# Altium schematic sheet USB.SchDoc
size A3; SheetNumber: 2; SheetTotal: 9
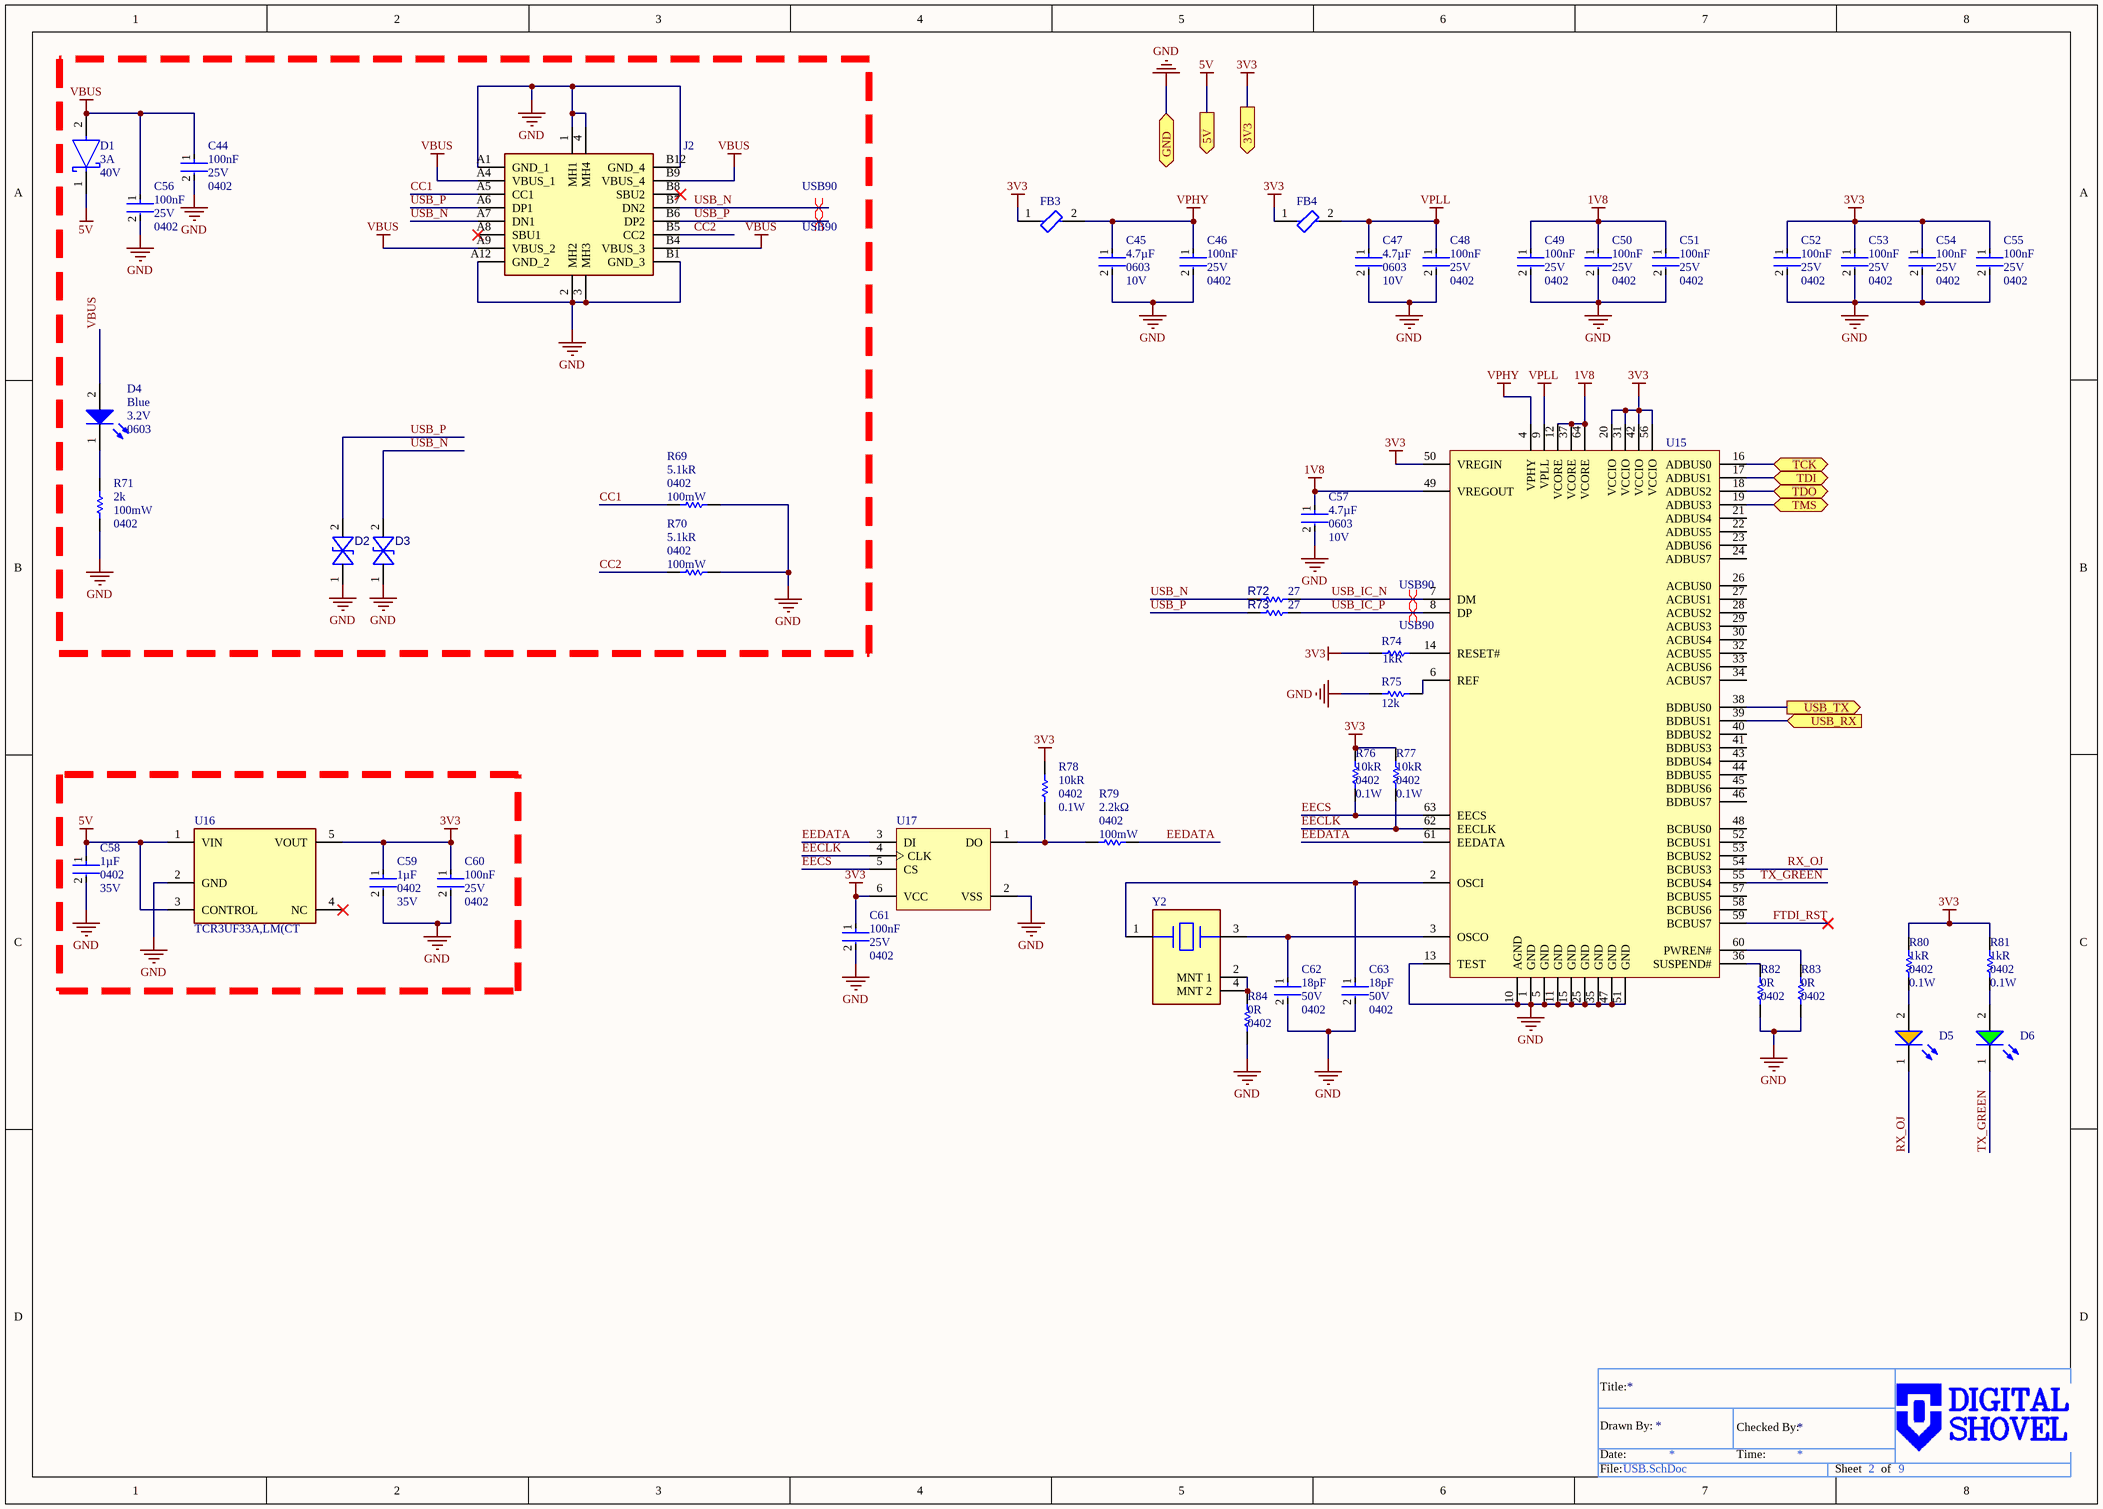
[diagram p0: USB.SchDoc]

## Parts
C44  value 100nF  Voltage Rating: 25V  Case/Package: 0402  [FP-CL830-IPC_A]  (hidden comment: CL05B104KA5NNNC)
C45  value 4.7µF  Case/Package: 0603  Voltage Rating: 10V  [FP-CL10-IPC_A]  (hidden comment: CL10A475KP8NNNC)
C46  value 100nF  Voltage Rating: 25V  Case/Package: 0402  [FP-CL830-IPC_A]  (hidden comment: CL05B104KA5NNNC)
C47  value 4.7µF  Case/Package: 0603  Voltage Rating: 10V  [FP-CL10-IPC_A]  (hidden comment: CL10A475KP8NNNC)
C48  value 100nF  Voltage Rating: 25V  Case/Package: 0402  [FP-CL830-IPC_A]  (hidden comment: CL05B104KA5NNNC)
C49  value 100nF  Voltage Rating: 25V  Case/Package: 0402  [FP-CL830-IPC_A]  (hidden comment: CL05B104KA5NNNC)
C50  value 100nF  Voltage Rating: 25V  Case/Package: 0402  [FP-CL830-IPC_A]  (hidden comment: CL05B104KA5NNNC)
C51  value 100nF  Voltage Rating: 25V  Case/Package: 0402  [FP-CL830-IPC_A]  (hidden comment: CL05B104KA5NNNC)
C52  value 100nF  Voltage Rating: 25V  Case/Package: 0402  [FP-CL830-IPC_A]  (hidden comment: CL05B104KA5NNNC)
C53  value 100nF  Voltage Rating: 25V  Case/Package: 0402  [FP-CL830-IPC_A]  (hidden comment: CL05B104KA5NNNC)
C54  value 100nF  Voltage Rating: 25V  Case/Package: 0402  [FP-CL830-IPC_A]  (hidden comment: CL05B104KA5NNNC)
C55  value 100nF  Voltage Rating: 25V  Case/Package: 0402  [FP-CL830-IPC_A]  (hidden comment: CL05B104KA5NNNC)
C56  value 100nF  Voltage Rating: 25V  Case/Package: 0402  [FP-CL830-IPC_A]  (hidden comment: CL05B104KA5NNNC)
C57  value 4.7µF  Case/Package: 0603  Voltage Rating: 10V  [FP-CL10-IPC_A]  (hidden comment: CL10A475KP8NNNC)
C58  value 1µF  Case/Package: 0402  Voltage Rating: 35V  [FP-C1005-050-0_05-IPC_A]  (hidden comment: C1005JB1V105K050BC)
C59  value 1µF  Case/Package: 0402  Voltage Rating: 35V  [FP-C1005-050-0_05-IPC_A]  (hidden comment: C1005JB1V105K050BC)
C60  value 100nF  Voltage Rating: 25V  Case/Package: 0402  [FP-CL830-IPC_A]  (hidden comment: CL05B104KA5NNNC)
C61  value 100nF  Voltage Rating: 25V  Case/Package: 0402  [FP-CL830-IPC_A]  (hidden comment: CL05B104KA5NNNC)
C62  value 18pF  Case/Package: 0402  Voltage Rating: 50V  [FP-GJM155-0_05-IPC_A]  (hidden comment: GJM1555C1H180GB01D)
C63  value 18pF  Case/Package: 0402  Voltage Rating: 50V  [FP-GJM155-0_05-IPC_A]  (hidden comment: GJM1555C1H180GB01D)
D1  value 3A  Voltage Rating: 40V  [FP-SOD123W-MFG]  (hidden comment: PMEG3020ER,115)
D2  TPD1E01B04DPYR  [TPD1E01B04DPYR-Footprint-1]  (value not drawn)
D3  TPD1E01B04DPYR  [TPD1E01B04DPYR-Footprint-1]  (value not drawn)
D4  Forward Voltage: 3.2V  Case/Package: 0603  Colour: Blue  [WL-SMCW_0603_150060xx75000]  (hidden comment: 150060BS75000)
D5  150060AS75000  [WL-SMCW_0603_150060xx75000]  (value not drawn)
D6  150060VS75000  [WL-SMCW_0603_150060xx75000]  (value not drawn)
FB3  BLM21PG300SN1D  [FP-BLM21-0_2-t0_85-e0_5-d-MFG]  (value not drawn)
FB4  BLM21PG300SN1D  [FP-BLM21-0_2-t0_85-e0_5-d-MFG]  (value not drawn)
J2  USB4145-03-0170-C  [GCT_USB4145-03-0170-C_REVA2]  (value not drawn)
R69  value 5.1kR  Package: 0402  Power: 100mW  [RESC1005X40X25LL10T10]  (hidden comment: RK73H1ETTP5101F)
R70  value 5.1kR  Package: 0402  Power: 100mW  [RESC1005X40X25LL10T10]  (hidden comment: RK73H1ETTP5101F)
R71  value 2k  Case/Package: 0402  Power: 100mW  [RESC1005X40X25LL10T10]  (hidden comment: RK73H1ETTP2001F)
R72  value 27  [RK73H1ETTP27R0F-Footprint-1]  (hidden comment: RK73H1ETTP27R0F)
R73  value 27  [RK73H1ETTP27R0F-Footprint-1]  (hidden comment: RK73H1ETTP27R0F)
R74  value 1kR  [RESC1005X40X25LL10T10]  (hidden comment: RK73H1ETTP1001F)
R75  value 12k  [RESC1005X40X25LL10T10]  (hidden comment: RK73H1ETTP1202F)
R76  value 10kR  Package: 0402  Power: 0.1W  [RESC1005X40X25LL10T10]  (hidden comment: RK73H1ETTP1002F)
R77  value 10kR  Package: 0402  Power: 0.1W  [RESC1005X40X25LL10T10]  (hidden comment: RK73H1ETTP1002F)
R78  value 10kR  Package: 0402  Power Rating: 0.1W  [RESC1005X40X25LL10T10]  (hidden comment: RK73H1ETTP1002F)
R79  value 2.2kΩ  Package: 0402  Rating: 100mW  [RK73H1ETTP2201F-Footprint-1]  (hidden comment: RK73H1ETTP2201F)
R80  value 1kR  Package: 0402  Power: 0.1W  [RESC1005X40X25LL10T10]  (hidden comment: RK73H1ETTP1001F)
R81  value 1kR  Package: 0402  Power: 0.1W  [RESC1005X40X25LL10T10]  (hidden comment: RK73H1ETTP1001F)
R82  value 0R  Package: 0402  [FP-RK73Z1E-IPC_B]  (hidden comment: RK73Z1ETTP)
R83  value 0R  Package: 0402  [FP-RK73Z1E-IPC_B]  (hidden comment: RK73Z1ETTP)
R84  value 0R  Package: 0402  [FP-RK73Z1E-IPC_B]  (hidden comment: RK73Z1ETTP)
U15  FT2232HL-REEL  [LQFP-64_M]  (value not drawn)
U16  TCR3UF33A,LM(CT  [TCR3UF33A,LM(CT-Footprint-1]
U17  93LC46BT-I/OT  [SOT-23-OT6_M]  (value not drawn)
Y2  ABM10-166-12.000MHZ-T3  [FP-ABM10-166-167-MFG]  (value not drawn)

## Ports
3V3 (out), 5V (out), GND (bidir), TCK (bidir), TDI (bidir), TDO (bidir), TMS (bidir), USB_RX (in), USB_TX (out)

## Nets
1V8: C49.1 C50.1 C51.1 C57.1 U15.12(VCORE) U15.37(VCORE) U15.49(VREGOUT) U15.64(VCORE)
3V3: C52.1 C53.1 C54.1 C55.1 C59.1 C60.1 C61.1 FB3.1 FB4.1 R74.1 R76.2 R77.2 R78.2 R80.2 R81.2 U15.20(VCCIO) U15.31(VCCIO) U15.42(VCCIO) U15.50(VREGIN) U15.56(VCCIO) U16.5(VOUT) U17.6(VCC) ; port 3V3
5V: C58.1 D1.1(C) U16.1(VIN) U16.3(CONTROL) ; port 5V
GND: C44.2 C45.2 C46.2 C47.2 C48.2 C49.2 C50.2 C51.2 C52.2 C53.2 C54.2 C55.2 C56.2 C57.2 C58.2 C59.2 C60.2 C61.2 C62.2 C63.2 D2.1 D3.1 J2.1(MH1) J2.2(MH2) J2.3(MH3) J2.4(MH4) J2.A1(GND_1) J2.A12(GND_2) J2.B1(GND_3) J2.B12(GND_4) R69.2 R70.2 R71.1 R75.1 R82.1 R83.1 R84.1 U15.1(GND) U15.5(GND) U15.10(AGND) U15.11(GND) U15.13(TEST) U15.15(GND) U15.25(GND) U15.35(GND) U15.47(GND) U15.51(GND) U16.2(GND) U17.2(VSS) ; port GND
VBUS: C44.1 C56.1 D1.2(A) D4.2(A) J2.A4(VBUS_1) J2.A9(VBUS_2) J2.B4(VBUS_3) J2.B9(VBUS_4)
VPHY: C45.1 C46.1 FB3.2 U15.4(VPHY)
VPLL: C47.1 C48.1 FB4.2 U15.9(VPLL)
CC1: J2.A5(CC1) R69.1
CC2: J2.B5(CC2) R70.1
EECLK: R77.1 U15.62(EECLK) U17.4(CLK)
EECS: R76.1 U15.63(EECS) U17.5(CS)
EEDATA: R79.2 U15.61(EEDATA) U17.3(DI)
FTDI_RST: U15.59(BCBUS7)
RX_OJ: D5.1(K) U15.54(BCBUS3)
TCK: U15.16(ADBUS0) ; port TCK
TDI: U15.17(ADBUS1) ; port TDI
TDO: U15.18(ADBUS2) ; port TDO
TMS: U15.19(ADBUS3) ; port TMS
TX_GREEN: D6.1(K) U15.55(BCBUS4)
USB_IC_N: R72.2 U15.7(DM)
USB_IC_P: R73.2 U15.8(DP)
USB_N: D3.2 J2.A7(DN1) J2.B7(DN2) R72.1
USB_P: D2.2 J2.A6(DP1) J2.B6(DP2) R73.1
USB_RX: U15.39(BDBUS1) ; port USB_RX
USB_TX: U15.38(BDBUS0) ; port USB_TX
NetC62_1: C62.1 U15.3(OSCO) Y2.3
NetC63_1: C63.1 U15.2(OSCI) Y2.1
NetD4_1: D4.1(K) R71.2
NetD5_2: D5.2(A) R80.1
NetD6_2: D6.2(A) R81.1
NetR74_2: R74.2 U15.14(RESET#)
NetR75_2: R75.2 U15.6(REF)
NetR78_1: R78.1 R79.1 U17.1(DO)
NetR82_2: R82.2 U15.36(SUSPEND#)
NetR83_2: R83.2 U15.60(PWREN#)
NetR84_2: R84.2 Y2.2(MNT_1) Y2.4(MNT_2)

Not connected (* = marked no-connect by the designer): J2 A8(SBU1)* B8(SBU2)*; U15 21(ADBUS4) 22(ADBUS5) 23(ADBUS6) 24(ADBUS7) 26(ACBUS0) 27(ACBUS1) 28(ACBUS2) 29(ACBUS3) 30(ACBUS4) 32(ACBUS5) 33(ACBUS6) 34(ACBUS7) 40(BDBUS2) 41(BDBUS3) 43(BDBUS4) 44(BDBUS5) 45(BDBUS6) 46(BDBUS7) 48(BCBUS0) 52(BCBUS1) 53(BCBUS2) 57(BCBUS5) 58(BCBUS6); U16 4(NC)*

## Layout directives
differential pair; differential pair class USB90: USB_IC_N, USB_IC_P, USB_N, USB_P

## Notes on the sheet
- Title:
- Date:
- Drawn By:
- Time:
- Checked By:
- File:
- Sheet
- of

## Library data of the parts
C44 C46 C48-C56 C60 C61 = CMP-001-00333-1: Ceramic Capacitor, Multilayer, Ceramic, 25V, 10% +Tol, 10% -Tol, X7R, 15% TC, 0.1uF, Surface Mount, 0402; Max Operating Temperature: 125°C; RoHS Compliant: Yes; Capacitor Type: Ceramic; Min Operating Temperature: -55°C; Pins: 2; Mounting Technology: Surface Mount
C45 C47 C57 = CMP-001-00331-1: Ceramic Capacitor, Multilayer, Ceramic, 10V, 10% +Tol, 10% -Tol, X5R, 15% TC, 4.7uF, Surface Mount, 0603; Capacitor Type: Ceramic; RoHS Compliant: Yes; Pins: 2; Mounting Technology: Surface Mount; Max Operating Temperature: 85°C; Min Operating Temperature: -55°C
C58 C59 = CMP-001-00329-1: Ceramic Capacitor, Multilayer, Ceramic, 35V, 10% +Tol, 10% -Tol, JB, 10% TC, 1uF, Surface Mount, 0402; Capacitor Type: Ceramic; Min Operating Temperature: -25°C; RoHS Compliant: Yes; Max Operating Temperature: 85°C; Pins: 2; Mounting Technology: Surface Mount
C62 C63 = CMP-001-00347-1: Ceramic Capacitor, Multilayer, Ceramic, 50V, 2% +Tol, 2% -Tol, C0G, 30ppm/Cel TC, 0.000018uF, Surface Mount, 0402; Max Operating Temperature: 125°C; RoHS Compliant: Yes; Pins: 2; Capacitor Type: Ceramic; Min Operating Temperature: -55°C; Mounting Technology: Surface Mount
D1 = CMP-x00083-1: Rectifier Diode, Schottky, 1 Phase, 1 Element, 3A, 40V V(RRM), Silicon; Manufacturer: Nexperia; Reel Width: 8mm; Template: NX_SOD_123W_2; Vendor: TTI; Category: Diodes; MOQ: 3000; Mounting: SMT; Package: SOD-123W-2; Price: 0.072
D2 D3 = CMP-004-00089-1: Trans Voltage Suppressor Diode, 27W, 3.6V V(RWM), Bidirectional, 1 Element, Silicon; RoHS Compliant: Yes
D4 = CMP-007-00049-1: Single Color LED, Blue, Water Clear, 1.1mm; Forward Current: 30mA; Pins: 2; Min Operating Temperature: -40°C; Max Operating Temperature: 85°C; Mounting Technology: Surface Mount; RoHS Compliant: Yes
D5 = CMP-007-00053-1: Single Color LED, Amber, Water Clear, 1.1mm; RoHS Compliant: Yes
D6 = CMP-007-00054-1: Single Color LED, Bright Green, Water Clear, 1.1mm; Forward Current: 30mA; Max Operating Temperature: 85°C; Pins: 2; RoHS Compliant: Yes; Mounting Technology: Surface Mount; Min Operating Temperature: -40°C
FB3 FB4 = CMP-0686-00620-3: Chip Ferrite Bead, 0805, 30Ω @ 100MHz, 0.014Ω, , 4A; Tolerance: 25%; Number of Circuits: 1; Impedance: 30R; Max DC Current: 3A; Shielding: Unshielded; Material: Steel; Resistance: 15mR; DC Resistance-Max: 14mR; Series: BLM21P; Military Standard: Not; Max Current Rating: 4A; Termination: SMD/SMT; Length: 2mm; Width: 1.25mm; Test Frequency: 100MHz; Packaging: Tape and Reel; Case/Package: 0805; Current Rating: 4A; Depth: 1.25mm; Package Quantity: 1; REACH SVHC: No SVHC; Core Material: Ferrite; Max Operating Temperature: 125°C; DC Current: 3A; Height: 0.85mm; Frequency: 100MHz; Number of Lines: 1; Case Code (Metric): 2012; Min Operating Temperature: -55°C; Radiation Hardening: No; Case Code (Imperial): 0805; Number of Pins: 2; RoHS Compliant: Yes; DC Resistance (DCR): 14mR; Lead Free: Lead Free
J2 = CMP-349-000000-01-A-3: USB Connectors USB-C Rec 3u Vert 16P SMT 1.7mm TH stakes H7.46mm T+R+Cap; MP: USB4145-03-0170-C_REVA2; Value: *; Availability: Unavailable; Pin Count: 20; Price: None; Package: None; Source: USB4145-03-0170-C_REVA2.SchLib; Design Item ID: USB4145-03-0170-C_REVA2; Component Type: Standard
R69 R70 = CMP-x00200-1: Fixed Resistor, Metal Glaze/thick Film, 0.1W, 5100ohm, 75V, 1% +/-Tol, 100ppm/Cel, Surface Mount, 0402; Manufacturer: KOA Speer; Template: KS_0402_R; Mounting: SMD; Category: Resistors
R71 = CMP-009-01011-1: Fixed Resistor, Metal Glaze/thick Film, 0.1W, 2000ohm, 75V, 1% +/-Tol, 100ppm/Cel, Surface Mount, 0402; Min Operating Temperature: -55°C; Pins: 2; Max Operating Temperature: 155°C; Tolerance: 1%; RoHS Compliant: Yes; Mounting Technology: Surface Mount
R72 R73 = CMP-009-01029-1: Fixed Resistor, Metal Glaze/thick Film, 0.1W, 27ohm, 75V, 1% +/-Tol, 100ppm/Cel, Surface Mount, 0402; Power: 100mW; Max Operating Temperature: 155°C; Tolerance: 1%; Case/Package: 0402; Pins: 2; RoHS Compliant: Yes; Min Operating Temperature: -55°C; Mounting Technology: Surface Mount
R74 R80 R81 = CMP-x00163-2: Fixed Resistor, Metal Glaze/thick Film, 0.1W, 1000ohm, 75V, 1% +/-Tol, 100ppm/Cel, Surface Mount, 0402; Manufacturer: KOA Speer; Template: KS_0402_R; Category: Resistors
R75 = CMP-009-01014-1: Fixed Resistor, Metal Glaze/thick Film, 0.1W, 12000ohm, 75V, 1% +/-Tol, 100ppm/Cel, Surface Mount, 0402; Power: 100mW; Max Operating Temperature: 155°C; Min Operating Temperature: -55°C; RoHS Compliant: Yes; Tolerance: 1%; Case/Package: 0402; Pins: 2; Mounting Technology: Surface Mount
R76-R78 = CMP-x00150-2: Fixed Resistor, Metal Glaze/thick Film, 0.1W, 10000ohm, 75V, 1% +/-Tol, 100ppm/Cel, Surface Mount, 0402; Template: KS_0402_R
R79 = CMP-x00008-4: Fixed Resistor, Metal Glaze/thick Film, 0.1W, 2200ohm, 75V, 1% +/-Tol, 100ppm/Cel, Surface Mount, 0402; Manufacturer: KOA Speer; Vendor: TTI; Reel Width: 8mm; Template: KS_0402_R; MOQ: 10000; Price: 0.00297; Category: Resistor; Mounting: SMT
R82-R84 = CMP-x00147-2: Metal Glaze/thick Film, 0ohm, Surface Mount, 0402; Template: KS_0402_R
U15 = CMP-x00055-5: USB Bus Controller, CMOS, PQFP64; Manufacturer: FTDI; Value: 3 - 5.25V; Template: FT_LQPF_64; Vendor: Mouser; MOQ: 1000; Price: 6.26; Mounting: SMD; Package: LQFP-64; Category: IC
U16 = CMP-x00051-5: (ldo) Linear Voltage Reg, Vin: 6; Manufacturer: Toshiba; Value: 5.5V; Template: TS_SOT_25; Vendor: TTI; Reel Width: 8mm; Mounting: SMT; Package: SOT-25; Price: 0.108; MOQ: 3000; Category: IC
U17 = CMP-x00087-2: EEPROM, 64X16, Serial, CMOS, PDSO6; Manufacturer: Microchip Technology; Reel Width: 8mm; Template: MT_SOT_23_6; Vendor: Microchip Direct; Category: IC; MOQ: 30000; Mounting: SMT; Package: SOT-23-6
Y2 = CMP-003-00032-4: Crystal 12MHz ±10ppm (Tol) ±10ppm (Stability) 8pF FUND 125Ohm 4-Pin SMD T/R; Manufacturer: TI; Vendor: TTI; Reel Size: 8mm; Template: TI_4_SMD; Category: Crystal; Price: 0.207; Rating: 8pF; MOQ: 3000; Value: 12MHz; Package: 4-SMD; Mounting Technology: SMT